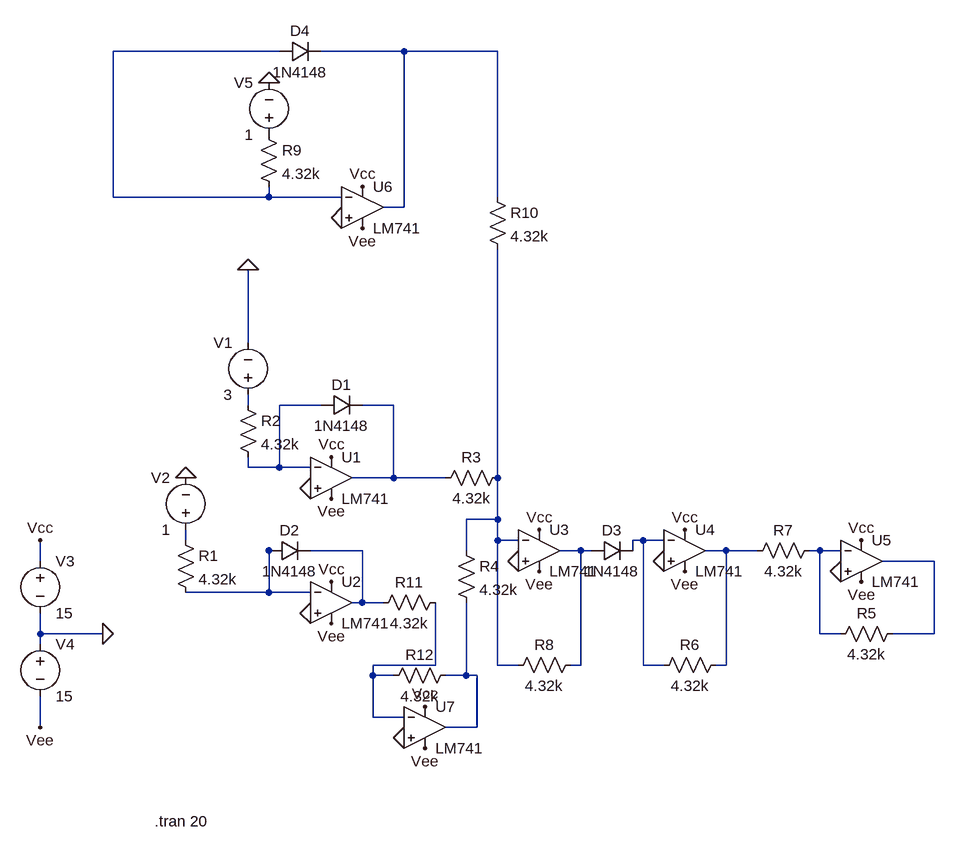
[diagram p0: schematic Multiplier.asc]
Multiplier.asc, the LTspice schematic file:
Version 4
SHEET 1 880 680
WIRE -176 -768 -432 -768
WIRE 16 -768 -112 -768
WIRE 160 -768 16 -768
WIRE -432 -544 -432 -768
WIRE -192 -544 -192 -560
WIRE -192 -544 -432 -544
WIRE -80 -544 -192 -544
WIRE 160 -544 160 -768
WIRE 16 -528 16 -768
WIRE 16 -528 -16 -528
WIRE -224 -320 -224 -432
WIRE -224 -224 -224 -240
WIRE -112 -224 -176 -224
WIRE 0 -224 -48 -224
WIRE -224 -128 -224 -144
WIRE -176 -128 -176 -224
WIRE -176 -128 -224 -128
WIRE -128 -128 -176 -128
WIRE 0 -112 0 -224
WIRE 0 -112 -64 -112
WIRE 80 -112 0 -112
WIRE 160 -112 160 -464
WIRE 160 -48 160 -112
WIRE 160 -48 112 -48
WIRE -320 -16 -320 -32
WIRE 160 -16 160 -48
WIRE 192 -16 160 -16
WIRE 384 -16 368 -16
WIRE 416 -16 384 -16
WIRE -176 0 -192 0
WIRE -48 0 -128 0
WIRE 112 0 112 -48
WIRE 288 0 256 0
WIRE 304 0 288 0
WIRE 368 0 368 -16
WIRE 512 0 480 0
WIRE 560 0 512 0
WIRE 656 0 640 0
WIRE 688 0 656 0
WIRE -544 16 -544 -16
WIRE 832 16 752 16
WIRE -192 64 -192 0
WIRE -192 64 -320 64
WIRE -128 64 -192 64
WIRE -48 80 -48 0
WIRE -48 80 -64 80
WIRE -16 80 -48 80
WIRE -544 128 -544 96
WIRE -448 128 -544 128
WIRE 656 128 656 0
WIRE 688 128 656 128
WIRE 832 128 832 16
WIRE 832 128 768 128
WIRE -544 144 -544 128
WIRE 64 176 64 80
WIRE 64 176 -32 176
WIRE 160 176 160 -16
WIRE 192 176 160 176
WIRE 288 176 288 0
WIRE 288 176 272 176
WIRE 384 176 384 -16
WIRE 416 176 384 176
WIRE 512 176 512 0
WIRE 512 176 496 176
WIRE -32 192 -32 176
WIRE 0 192 -32 192
WIRE 112 192 112 80
WIRE 112 192 80 192
WIRE 128 192 112 192
WIRE -32 256 -32 192
WIRE 16 256 -32 256
WIRE -544 272 -544 224
WIRE 128 272 128 192
WIRE 128 272 80 272
FLAG -448 128 0
FLAG -544 -16 Vcc
FLAG -544 272 Vee
FLAG 192 16 0
FLAG 416 16 0
FLAG 688 32 0
FLAG -128 -96 0
FLAG -128 96 0
FLAG -224 -432 0
FLAG -320 -112 0
FLAG -96 -80 Vee
FLAG -96 112 Vee
FLAG 448 32 Vee
FLAG 720 48 Vee
FLAG -96 48 Vcc
FLAG 224 -32 Vcc
FLAG 448 -32 Vcc
FLAG 720 -16 Vcc
FLAG 224 32 Vee
FLAG -96 -144 Vcc
FLAG -80 -512 0
FLAG -192 -720 0
FLAG -48 -560 Vcc
FLAG -48 -496 Vee
FLAG 48 240 Vcc
FLAG 48 304 Vee
FLAG 16 288 0
SYMBOL voltage -544 0 R0
WINDOW 123 0 0 Left 2
WINDOW 39 0 0 Left 2
SYMATTR InstName V3
SYMATTR Value 15
SYMBOL voltage -544 128 R0
WINDOW 123 0 0 Left 2
WINDOW 39 0 0 Left 2
SYMATTR InstName V4
SYMATTR Value 15
SYMBOL LM741 -96 -176 R0
SYMATTR InstName U1
SYMBOL LM741 -96 16 R0
SYMATTR InstName U2
SYMBOL LM741 224 -64 R0
SYMATTR InstName U3
SYMBOL LM741 448 -64 R0
SYMATTR InstName U4
SYMBOL diode -112 -240 M90
WINDOW 0 0 32 VBottom 2
WINDOW 3 32 32 VTop 2
SYMATTR InstName D1
SYMATTR Value 1N4148
SYMBOL diode -192 -16 M90
WINDOW 0 0 32 VBottom 2
WINDOW 3 32 32 VTop 2
SYMATTR InstName D2
SYMATTR Value 1N4148
SYMBOL diode 304 -16 M90
WINDOW 0 0 32 VBottom 2
WINDOW 3 32 32 VTop 2
SYMATTR InstName D3
SYMATTR Value 1N4148
SYMBOL LM741 720 -48 R0
SYMATTR InstName U5
SYMBOL res -336 -32 R0
SYMATTR InstName R1
SYMATTR Value 4.32k
SYMBOL res -240 -240 R0
SYMATTR InstName R2
SYMATTR Value 4.32k
SYMBOL voltage -224 -224 R180
WINDOW 0 24 96 Left 2
WINDOW 3 24 16 Left 2
WINDOW 123 0 0 Left 2
WINDOW 39 0 0 Left 2
SYMATTR InstName V1
SYMATTR Value 3
SYMBOL voltage -320 -16 R180
WINDOW 0 24 96 Left 2
WINDOW 3 24 16 Left 2
WINDOW 123 0 0 Left 2
WINDOW 39 0 0 Left 2
SYMATTR InstName V2
SYMATTR Value 1
SYMBOL res 176 -128 R90
WINDOW 0 0 56 VBottom 2
WINDOW 3 32 56 VTop 2
SYMATTR InstName R3
SYMATTR Value 4.32k
SYMBOL res 784 112 R90
WINDOW 0 0 56 VBottom 2
WINDOW 3 32 56 VTop 2
SYMATTR InstName R5
SYMATTR Value 4.32k
SYMBOL res 512 160 R90
WINDOW 0 0 56 VBottom 2
WINDOW 3 32 56 VTop 2
SYMATTR InstName R6
SYMATTR Value 4.32k
SYMBOL res 288 160 R90
WINDOW 0 0 56 VBottom 2
WINDOW 3 32 56 VTop 2
SYMATTR InstName R8
SYMATTR Value 4.32k
SYMBOL res 656 -16 R90
WINDOW 0 0 56 VBottom 2
WINDOW 3 32 56 VTop 2
SYMATTR InstName R7
SYMATTR Value 4.32k
SYMBOL LM741 -48 -592 R0
SYMATTR InstName U6
SYMBOL res -208 -656 R0
SYMATTR InstName R9
SYMATTR Value 4.32k
SYMBOL diode -176 -784 M90
WINDOW 0 0 32 VBottom 2
WINDOW 3 32 32 VTop 2
SYMATTR InstName D4
SYMATTR Value 1N4148
SYMBOL voltage -192 -624 R180
WINDOW 0 24 96 Left 2
WINDOW 3 24 16 Left 2
WINDOW 123 0 0 Left 2
WINDOW 39 0 0 Left 2
SYMATTR InstName V5
SYMATTR Value 1
SYMBOL res 144 -560 R0
SYMATTR InstName R10
SYMATTR Value 4.32k
SYMBOL res 80 64 R90
WINDOW 0 0 56 VBottom 2
WINDOW 3 32 56 VTop 2
SYMATTR InstName R11
SYMATTR Value 4.32k
SYMBOL LM741 48 208 R0
SYMATTR InstName U7
SYMBOL res 96 -16 R0
SYMATTR InstName R4
SYMATTR Value 4.32k
SYMBOL res 96 176 R90
WINDOW 0 0 56 VBottom 2
WINDOW 3 32 56 VTop 2
SYMATTR InstName R12
SYMATTR Value 4.32k
TEXT -368 416 Left 2 !.tran 20

The netlist it stands for:
* Multiplier.asc
V3 Vcc 0 15
V4 0 Vee 15
XU1 0 N004 Vcc Vee N005 LM741  ; pins In+ In- V+ V- OUT
XU2 0 N009 Vcc Vee N010 LM741  ; pins In+ In- V+ V- OUT
XU3 0 N006 Vcc Vee N011 LM741  ; pins In+ In- V+ V- OUT
XU4 0 N008 Vcc Vee N012 LM741  ; pins In+ In- V+ V- OUT
D1 N004 N005 1N4148
D2 N009 N010 1N4148
D3 N011 N008 1N4148
XU5 0 N013 Vcc Vee N014 LM741  ; pins In+ In- V+ V- OUT
R1 N007 N009 4.32k
R2 N003 N004 4.32k
V1 N003 0 3
V2 N007 0 1
R3 N006 N005 4.32k
R5 N014 N013 4.32k
R6 N012 N008 4.32k
R8 N011 N006 4.32k
R7 N013 N012 4.32k
XU6 0 N001 Vcc Vee N002 LM741  ; pins In+ In- V+ V- OUT
R9 P001 N001 4.32k
D4 N001 N002 1N4148
V5 P001 0 1
R10 N002 N006 4.32k
R11 N015 N010 4.32k
XU7 0 N015 Vcc Vee N016 LM741  ; pins In+ In- V+ V- OUT
R4 N006 N016 4.32k
R12 N016 N015 4.32k
.model D D
.lib standard.dio
.tran 20
.lib LM741.lib
.backanno
.end